# EAGLE schematic AtmegaRFM69_through_hole (EAGLE 6.5.0)
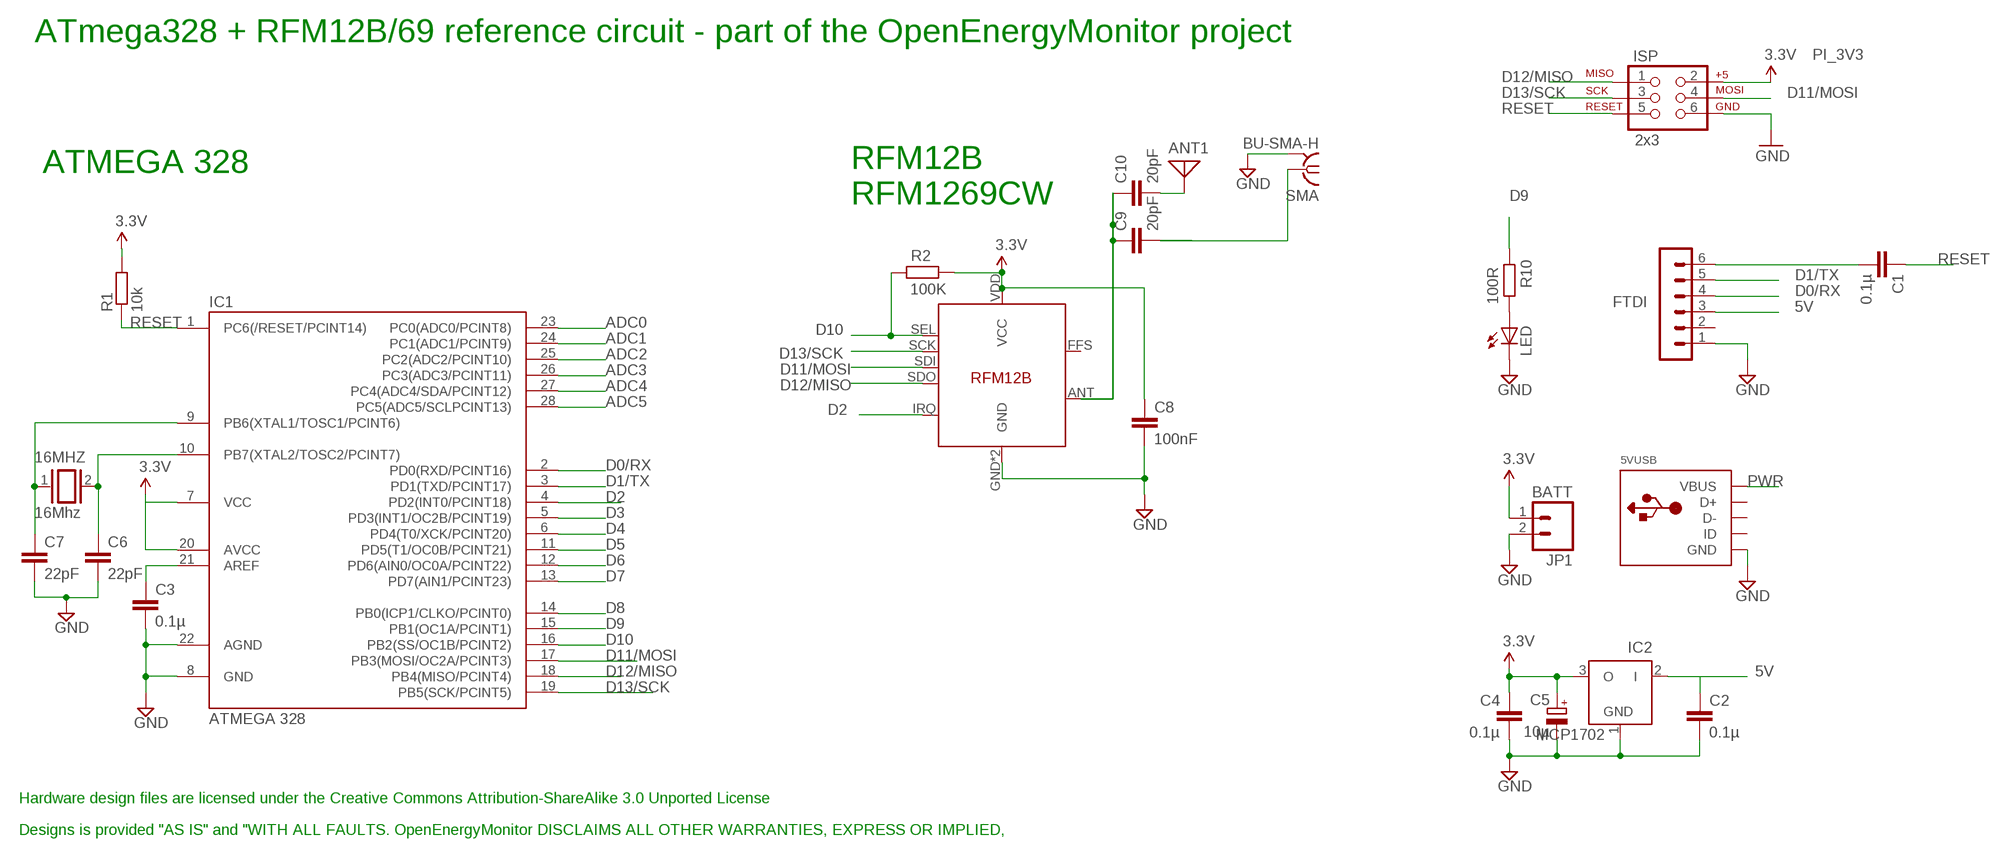
[diagram p0: schematic, sheet 1]

## Parts
5VUSB  USBMOLEX  [USB-MINIB-THM-MOLEX]
16MHZ  16Mhz  XTAL/S  [QS]
ANT1  ANTENNA  [PAD-01]
C1  0.1µ  C-EU025-024X044  [C025-024X044]
C2  0.1µ  C-EU025-024X044  [C025-024X044]
C3  0.1µ  C-EU025-024X044  [C025-024X044]
C4  0.1µ  C-EU025-024X044  [C025-024X044]
C5  10µ  CPOL-EUE1.8-4  [E1,8-4]
C6  22pF  C2.5/2  [C2.5-2]
C7  22pF  C2.5/2  [C2.5-2]
C8  100nF  C-EU025-024X044  [C025-024X044]
C9  20pF  C-EU025-024X044  [C025-024X044]
C10  20pF  C-EU025-024X044  [C025-024X044]
FTDI  FTDI  MA06-1  [MA06-1]
IC1  ATMEGA 328  ATMEGA48/88/168-PU  [DIL28-3]
IC2  MCP1702  MCP1702Z  [TO92]
ISP  2x3  AVR_SPI_PRG_6PTH  [2X3]
JP1  BATT  M02LOCK_LONGPADS  [1X02_LOCK_LONGPADS]
LED  LED3MM  [LED3MM]
R1  10k  R-EU_0204/7  [0204/7]
R2  100K  R-EU_0204/7  [0204/7]
R10  100R  R-EU_0204/7  [0204/7]
SMA  BU-SMA-H  [BU-SMA-H]
U$14  RFM12B  [RFM12B]

## Nets
3.3V: C4.1 C5.+ C8.1 IC1.7(VCC) IC1.20(AVCC) IC2.3(O) ISP.2 JP1.1 R1.2 R2.1 U$14.VDD(VCC)
5V [power]: C2.1 FTDI.3 IC2.2(I)
ADC0: IC1.23(PC0(ADC0/PCINT8))
ADC1: IC1.24(PC1(ADC1/PCINT9))
ADC2: IC1.25(PC2(ADC2/PCINT10))
ADC3: IC1.26(PC3(ADC3/PCINT11))
ADC4: IC1.27(PC4(ADC4/SDA/PCINT12))
ADC5: IC1.28(PC5(ADC5/SCLPCINT13))
D0/RX: FTDI.4 IC1.2(PD0(RXD/PCINT16))
D1/TX: FTDI.5 IC1.3(PD1(TXD/PCINT17))
D2: IC1.4(PD2(INT0/PCINT18)) U$14.IRQ
D3: IC1.5(PD3(INT1/OC2B/PCINT19))
D4: IC1.6(PD4(T0/XCK/PCINT20))
D5: IC1.11(PD5(T1/OC0B/PCINT21))
D6: IC1.12(PD6(AIN0/OC0A/PCINT22))
D7: IC1.13(PD7(AIN1/PCINT23))
D8: IC1.14(PB0(ICP1/CLKO/PCINT0))
D9: IC1.15(PB1(OC1A/PCINT1)) R10.2
D10: IC1.16(PB2(SS/OC1B/PCINT2)) R2.2 U$14.SEL
D11/MOSI: IC1.17(PB3(MOSI/OC2A/PCINT3)) ISP.4 U$14.SDI
D12/MISO: IC1.18(PB4(MISO/PCINT4)) ISP.1 U$14.SDO
D13/SCK: IC1.19(PB5(SCK/PCINT5)) ISP.3 U$14.SCK
DIG1: C9.1 C10.1 U$14.ANT
GND [power]: 5VUSB.GND C2.2 C3.2 C4.2 C5.- C6.2 C7.2 C8.2 FTDI.1 IC1.8(GND) IC1.22(AGND) IC2.1(GND) ISP.6 JP1.2 LED.K(C) SMA.2 SMA.3 SMA.4 SMA.5 U$14.GND U$14.P$12(GND)
N$1: 16MHZ.2 C6.1 IC1.10(PB7(XTAL2/TOSC2/PCINT7))
N$8: LED.A R10.1
N$11: ANT1.1 C10.2
N$12: 16MHZ.1 C7.1 IC1.9(PB6(XTAL1/TOSC1/PCINT6))
N$15: C1.2 FTDI.6
N$19: C3.1 IC1.21(AREF)
N$24: C9.2 SMA.1
PWR [power]: 5VUSB.VBUS
RESET: C1.1 IC1.1(PC6(/RESET/PCINT14)) ISP.5 R1.1
Unconnected: 5VUSB.D+ 5VUSB.D- 5VUSB.ID FTDI.2 U$14.FFS

## Notes on the sheet
- ATmega328 + RFM12B/69 reference circuit - part of the OpenEnergyMonitor project
- ATMEGA 328
- RFM12B
  RFM1269CW
- Hardware design files are licensed under the Creative Commons Attribution-ShareAlike 3.0 Unported License
- Designs is provided "AS IS" and "WITH ALL FAULTS. OpenEnergyMonitor DISCLAIMS ALL OTHER WARRANTIES, EXPRESS OR IMPLIED,

## Library data of the parts
5VUSB = adafruit:USB: USB Connectors USBMINIB - Surface Mount Female Mini-B USB Connector 4UConnector: 06564 By microbuilder.eu Thru-hole RA Female Mini-B USB Connector 4UConnector: 18732 By ladyada.net
16MHZ = special:XTAL/S: CRYSTAL
ANT1 = discrete:ANTENNA: Antenna
C1-C4 C8-C10 = resistor:C-EU: CAPACITOR, European symbol
C5 = resistor:CPOL-EU: POLARIZED CAPACITOR, European symbol
C6 C7 = capacitor-wima:C: CAPACITOR naming: grid - package width
FTDI = JeeLabs:MA06-1: PIN HEADER
IC1 = atmega8:ATMEGA48/88/168-PU
IC2 = JeeLabs:MCP1702: 200 mA, Low Power Low Dropout Voltage Regulator
ISP = SparkFun:AVR_SPI_PRG_6: AVR ISP 6 Pin This is the reduced ISP connector for AVR programming. Common on Arduino. This footprint will take up less PCB space and can be used with a 10-pin to 6-pin adapter such as SKU: BOB-08508
JP1 = SparkFun:M02: Header 2 Standard 2-pin 0.1" header. Use with straight break away headers (SKU : PRT-00116), right angle break away headers (PRT-00553), swiss pins (PRT-00743), machine pins (PRT-00117), and female headers (PRT-00115). Molex polarized connector foot print use with SKU : PRT-08233 with associated crimp pins and housings.
LED = adafruit:LED: LED OSRAM: - CHIPLED LG R971, LG N971, LY N971, LG Q971, LY Q971, LO R971, LY R971 LH N974, LH R974 LS Q976, LO Q976, LY Q976 LO Q996 - Hyper CHIPLED LW Q18S LB Q993, LB Q99A, LB R99A - SideLED LS A670, LO A670, LY A670, LG A670, LP A670 LB A673, LV A673, LT A673, LW A673 LH A674 LY A675 LS A676, LA A676, LO A676, LY A676, LW A676 LS A679, LY A679, LG A679 - Hyper Micro SIDELED® LS Y876, LA Y876, LO Y876, LY Y876 LT Y87S - SmartLED LW L88C, LW L88S LB L89C, LB L89S, LG L890 LS L89K, LO L89K, LY L89K LS L896, LA L896, LO L896, LY L896 - TOPLED LS T670, LO T670, LY T670, LG T670, LP T670 LSG T670, LSP T670, LSY T670, LOP T670, LYG T670 LG T671, LOG T671, LSG T671 LB T673, LV T673, LT T673, LW T673 LH T674 LS T676, LA T676, LO T676, LY T676, LB T676, LH T676, LSB T676, LW T676 LB T67C, LV T67C, LT T67C, LS T67K, LO T67K, LY T67K, LW E67C LS E67B, LA E67B, LO E67B, LY E67B, LB E67C, LV E67C, LT E67C LW T67C LS T679, LY T679, LG T679 LS T770, LO T770, LY T770, LG T770, LP T770 LB T773, LV T773, LT T773, LW T773 LH T774 LS E675, LA E675, LY E675, LS T675 LS T776, LA T776, LO T776, LY T776, LB T776 LHGB T686 LT T68C, LB T68C - Hyper Mini TOPLED® LB M676 - Mini TOPLED Santana® LG M470 LS M47K, LO M47K, LY M47K Source: http://www.osram.convergy.de/
R1 = resistor:R-EU_: RESISTOR, European symbol
R2 R10 = rcl:R-EU_: RESISTOR, European symbol
SMA = con-coax:BU-SMA-H: FEMALE SMA CONNECTOR Radiall; OC_FARNELL: unknown; OC_NEWARK: unknown
U$14 = JeeParts:RFM12B

## Net classes
0 default: width 0.203 mm, drill 0.6 mm, clearance 0.203 mm
1 power: width 0.381 mm, drill 0.6 mm, clearance 0.254 mm
2 gnd: width 0.254 mm, drill 0.6 mm, clearance 0.254 mm